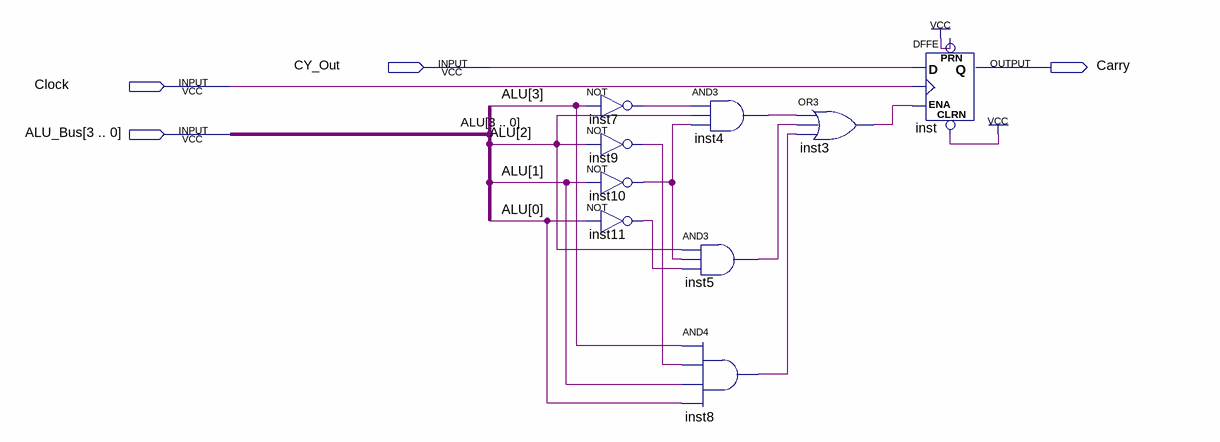
[diagram p0: schematic sheet]
// Quartus schematic Carry_Block.bdf as structural Verilog: 9 symbols, 4 pins
module Carry_Block (
  input  CY_Out,
  input  Clock,
  input  [3:0] ALU_Bus,
  output Carry
);

  wire inst3_out, inst4_out, inst5_out, inst7_out, inst8_out, inst9_out, inst10_out, inst11_out;

  not inst7 (inst7_out, ALU_Bus[3]);
  not inst9 (inst9_out, ALU_Bus[2]);
  not inst10 (inst10_out, ALU_Bus[1]);
  not inst11 (inst11_out, ALU_Bus[0]);
  and inst4 (inst4_out, inst7_out, ALU_Bus[2], inst10_out);
  and inst5 (inst5_out, ALU_Bus[2], inst10_out, inst11_out);
  and inst8 (inst8_out, ALU_Bus[3], inst9_out, ALU_Bus[1], ALU_Bus[0]);
  or inst3 (inst3_out, inst4_out, inst5_out, inst8_out);
  DFFE inst (.PRN(1'b1), .CLRN(1'b1), .D(CY_Out), .CLK(Clock), .ENA(inst3_out), .Q(Carry));

  // Other names for the same wires on the sheet: ALU[3:0] = ALU_Bus
endmodule
